# Altium schematic sheet Motors_DCVs.SchDoc
size C; SheetNumber: 3; SheetTotal: 4
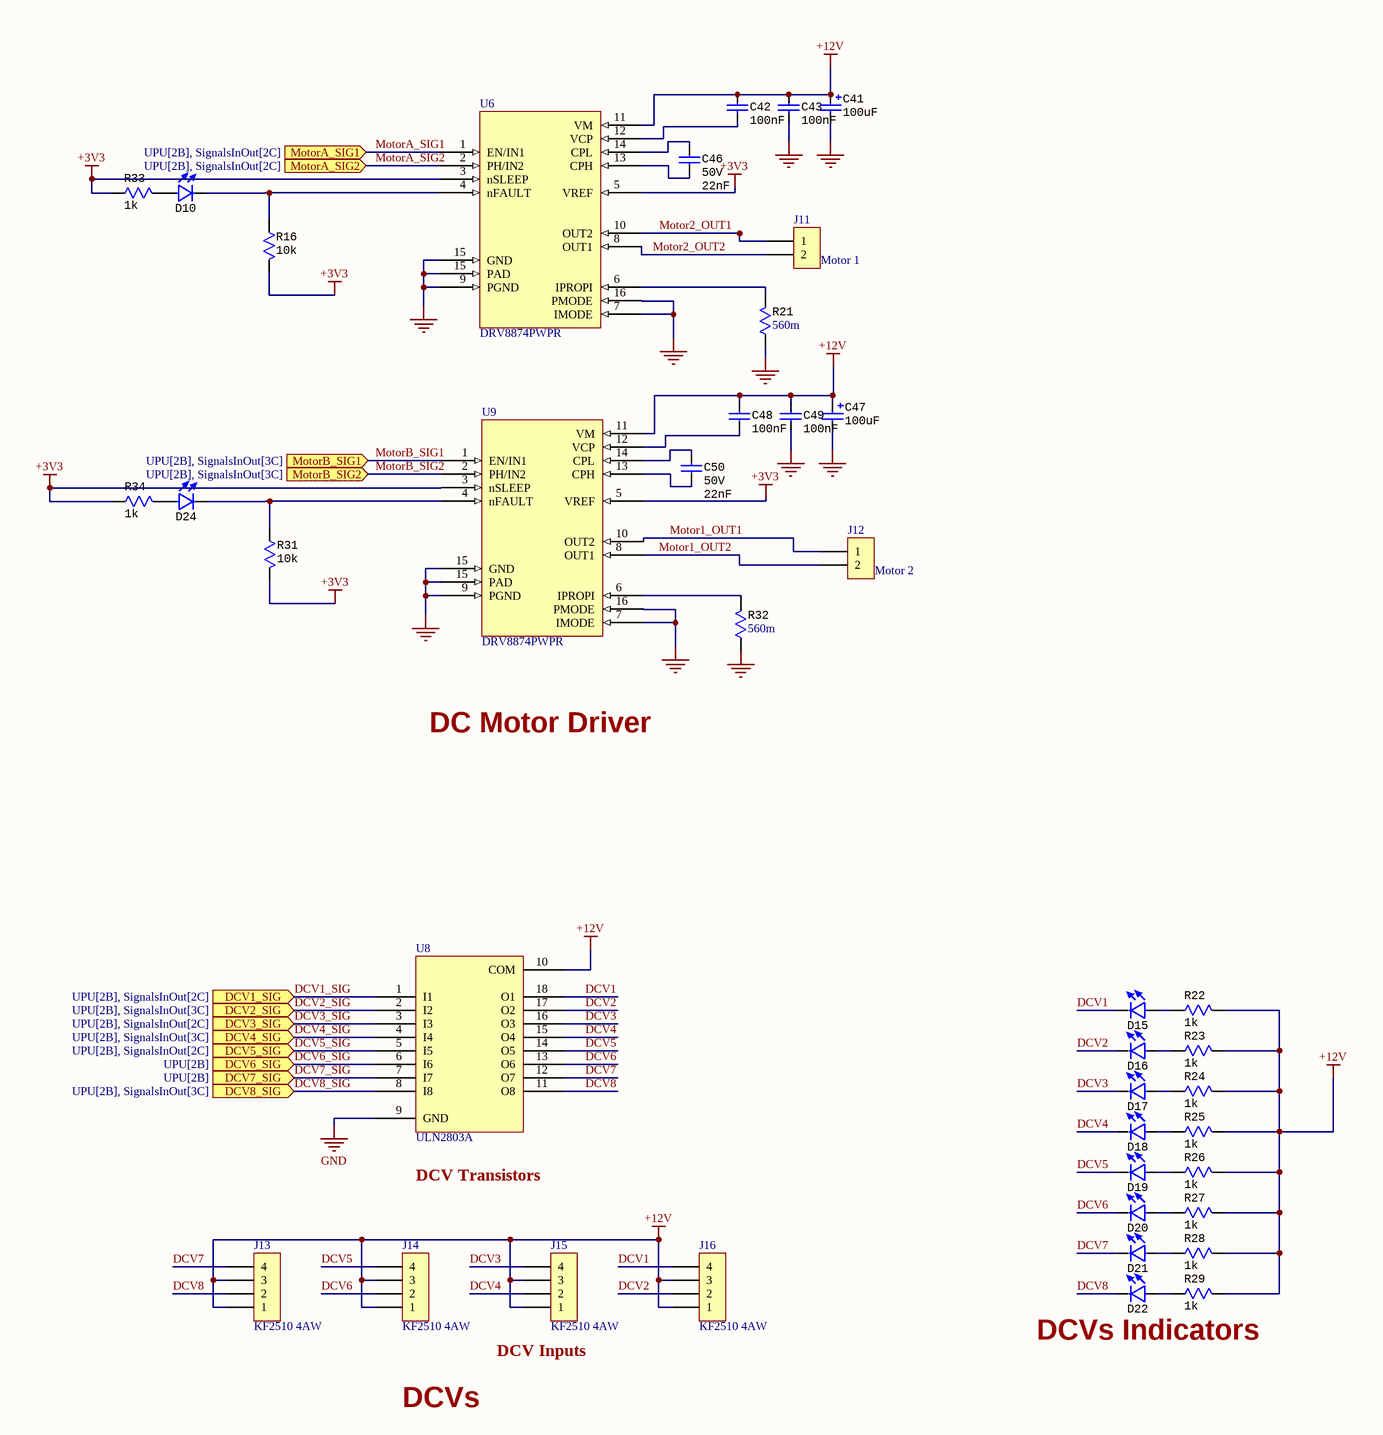
[diagram p0: Motors_DCVs.SchDoc]

## Parts
C41  100uF  [CAP Electrolytic SMD G_10X10.3X10.2(CPOL-EU153CLV-1010)]
C42  100nF  [CAP Ceramic SMD 0603]
C43  100nF  [CAP Ceramic SMD 0603]
C46  Voltage: 50V  [CAP Ceramic SMD 0603]  (hidden comment: 22nF)
C47  100uF  [CAP Electrolytic SMD G_10X10.3X10.2(CPOL-EU153CLV-1010)]
C48  100nF  [CAP Ceramic SMD 0603]
C49  100nF  [CAP Ceramic SMD 0603]
C50  Voltage: 50V  [CAP Ceramic SMD 0603]  (hidden comment: 22nF)
D10  (no value)  [LED SMD 0805R]
D15  (no value)  [LED SMD 0805G]
D16  (no value)  [LED SMD 0805G]
D17  (no value)  [LED SMD 0805G]
D18  (no value)  [LED SMD 0805G]
D19  (no value)  [LED SMD 0805G]
D20  (no value)  [LED SMD 0805G]
D21  (no value)  [LED SMD 0805G]
D22  (no value)  [LED SMD 0805G]
D24  (no value)  [LED SMD 0805R]
J11  Motor 1  [Connector MOLEX KK-254 KF2510-2AW 2 90deg]
J12  Motor 2  [Connector MOLEX KK-254 KF2510-2AW 2 90deg]
J13  KF2510 4AW  [Connector MOLEX KK-254 KF2510-4AW 4 90deg]
J14  KF2510 4AW  [Connector MOLEX KK-254 KF2510-4AW 4 90deg]
J15  KF2510 4AW  [Connector MOLEX KK-254 KF2510-4AW 4 90deg]
J16  KF2510 4AW  [Connector MOLEX KK-254 KF2510-4AW 4 90deg]
R16  value 10k  [RES SMD 0603]  (hidden comment: 10kR)
R21  560m  [RES SMD 0603]
R22  value 1k  [RES SMD 0603]  (hidden comment: 1kR)
R23  value 1k  [RES SMD 0603]  (hidden comment: 1kR)
R24  value 1k  [RES SMD 0603]  (hidden comment: 1kR)
R25  value 1k  [RES SMD 0603]  (hidden comment: 1kR)
R26  value 1k  [RES SMD 0603]  (hidden comment: 1kR)
R27  value 1k  [RES SMD 0603]  (hidden comment: 1kR)
R28  value 1k  [RES SMD 0603]  (hidden comment: 1kR)
R29  value 1k  [RES SMD 0603]  (hidden comment: 1kR)
R31  value 10k  [RES SMD 0603]  (hidden comment: 10kR)
R32  560m  [RES SMD 0603]
R33  value 1k  [RES SMD 0603]  (hidden comment: 1kR)
R34  value 1k  [RES SMD 0603]  (hidden comment: 1kR)
U6  DRV8874PWPR  [DRV8874PWPR]
U8  ULN2803A  [ULN2803A]
U9  DRV8874PWPR  [DRV8874PWPR]

## Ports
DCV1_SIG (in, see UPU[2B], SignalsInOut[2C]), DCV2_SIG (in, see UPU[2B], SignalsInOut[3C]), DCV3_SIG (in, see UPU[2B], SignalsInOut[2C]), DCV4_SIG (in, see UPU[2B], SignalsInOut[3C]), DCV5_SIG (in, see UPU[2B], SignalsInOut[2C]), DCV6_SIG (in, see UPU[2B]), DCV7_SIG (in, see UPU[2B]), DCV8_SIG (in, see UPU[2B], SignalsInOut[3C]), MotorA_SIG1 (in, see UPU[2B], SignalsInOut[2C]), MotorA_SIG2 (in, see UPU[2B], SignalsInOut[2C]), MotorB_SIG1 (in, see UPU[2B], SignalsInOut[3C]), MotorB_SIG2 (in, see UPU[2B], SignalsInOut[3C])

## Nets
+3V3: R16.2 R31.2 R33.1 R34.1 U6.3(nSLEEP) U6.5(VREF) U9.3(nSLEEP) U9.5(VREF)
+12V: C41.1 C42.1 C43.1 C47.1 C48.1 C49.1 J13.1 J13.3 J14.1 J14.3 J15.1 J15.3 J16.1 J16.3 R22.2 R23.2 R24.2 R25.2 R26.2 R27.2 R28.2 R29.2 U6.11(VM) U8.10(COM) U9.11(VM)
GND: C41.2 C43.2 C47.2 C49.2 R21.1 R32.1 U6.7(IMODE) U6.9(PGND) U6.15(GND) U6.16(PMODE) U8.9(GND) U9.7(IMODE) U9.9(PGND) U9.15(GND) U9.16(PMODE)
DCV1: D15.2 J16.4 U8.18(O1)
DCV1_SIG: U8.1(I1) ; port DCV1_SIG
DCV2: D16.2 J16.2 U8.17(O2)
DCV2_SIG: U8.2(I2) ; port DCV2_SIG
DCV3: D17.2 J15.4 U8.16(O3)
DCV3_SIG: U8.3(I3) ; port DCV3_SIG
DCV4: D18.2 J15.2 U8.15(O4)
DCV4_SIG: U8.4(I4) ; port DCV4_SIG
DCV5: D19.2 J14.4 U8.14(O5)
DCV5_SIG: U8.5(I5) ; port DCV5_SIG
DCV6: D20.2 J14.2 U8.13(O6)
DCV6_SIG: U8.6(I6) ; port DCV6_SIG
DCV7: D21.2 J13.4 U8.12(O7)
DCV7_SIG: U8.7(I7) ; port DCV7_SIG
DCV8: D22.2 J13.2 U8.11(O8)
DCV8_SIG: U8.8(I8) ; port DCV8_SIG
Motor1_OUT1: J12.1 U9.10(OUT2)
Motor1_OUT2: J12.2 U9.8(OUT1)
Motor2_OUT1: J11.1 U6.10(OUT2)
Motor2_OUT2: J11.2 U6.8(OUT1)
MotorA_SIG1: U6.1(EN/IN1) ; port MotorA_SIG1
MotorA_SIG2: U6.2(PH/IN2) ; port MotorA_SIG2
MotorB_SIG1: U9.1(EN/IN1) ; port MotorB_SIG1
MotorB_SIG2: U9.2(PH/IN2) ; port MotorB_SIG2
NetC42_2: C42.2 U6.12(VCP)
NetC46_1: C46.1 U6.14(CPL)
NetC46_2: C46.2 U6.13(CPH)
NetC48_2: C48.2 U9.12(VCP)
NetC50_1: C50.1 U9.14(CPL)
NetC50_2: C50.2 U9.13(CPH)
NetD10_1: D10.1 R33.2
NetD10_2: D10.2 R16.1 U6.4(nFAULT)
NetD15_1: D15.1 R22.1
NetD16_1: D16.1 R23.1
NetD17_1: D17.1 R24.1
NetD18_1: D18.1 R25.1
NetD19_1: D19.1 R26.1
NetD20_1: D20.1 R27.1
NetD21_1: D21.1 R28.1
NetD22_1: D22.1 R29.1
NetD24_1: D24.1 R34.2
NetD24_2: D24.2 R31.1 U9.4(nFAULT)
NetR21_2: R21.2 U6.6(IPROPI)
NetR32_2: R32.2 U9.6(IPROPI)

## Notes on the sheet
- DC Motor Driver
- (near U8) DCV Transistors
- (near J15) DCV Inputs
- DCVs Indicators
- DCVs

## Library data of the parts
C41 C47 = CAP ELEC 100uF 68V: -40℃~+105℃ 2000hrs@105℃ 100uF 10.2mm 63V 10mm ±20% SMD,D10xL10.2mm Aluminum Electrolytic Capacitors - SMD ROHS; Manufacturer: ROQANG; Manufacturer Part Number: RT1J101M1010; ComponentLink1Description: Datasheet; ComponentLink1URL: https://datasheet.lcsc.com/lcsc/1809061214_Nichicon-UWX1C101MCL1GB_C111600.pdf; Supplier: LCSC; Supplier Part Number: C280414; Capacitance: 100uF
C42 C43 C48 C49 = CAP 0603 100nF 100V: 0603 0.1 uF 100 V ±10% Tolerance X7R Multilayer Ceramic Capacitor; Manufacturer: Yageo; Manufacturer Part Number: AC0603KRX7R0BB104; Voltage Rating: 100V; Supplier: LCSC; Supplier Part Number: C408909; RoHS: Yes; Category: Ceramic Capacitors; Stock 1: 6927977; Pricing 1: 1=0.17000, 10=0.11900, 50=0.06760, 100=0.05590, 500=0.03922, 1000=0.03246 (USD); Mount: Surface Mount; Case/Package: 0603; Case Code (Metric): 1608; Case Code (Imperial): 0603; Weight: 7.1E-05oz; Min Operating Temperature: -55°C; Max Operating Temperature: 125°C; Package Quantity: 4000; Capacitance: 100nF; Tolerance: 10%; Packaging: Tape and Reel; Dielectric: X7R; Termination: SMD/SMT; Resistor Type: Ceramic; Voltage Rating (DC): 100V; Series: CC; Length: 0.063inch; Width: 0.031inch; Thickness: 0.035inch; Depth: 0.8mm; Lead Free: Lead Free; RoHS Compliant: Yes; ComponentLink1URL: https://datasheet.ciiva.com/6277/mlccorderingcode-6277082.pdf?src-supplier=Digi-Key; ComponentLink1Description: https://datasheet.ciiva.com/6277/mlccorderingcode-6277082.pdf?src-supplier=Digi-Key; ComponentLink2URL: https://datasheet.ciiva.com/6277/mlccorderingcode-6277081.pdf?src-supplier=Digi-Key; ComponentLink2Description: https://datasheet.ciiva.com/6277/mlccorderingcode-6277081.pdf?src-supplier=Digi-Key; ComponentLink3URL: https://datasheet.ciiva.com/6277/mlccorderingcode-6277030.pdf?src-supplier=Digi-Key; ComponentLink3Description: https://datasheet.ciiva.com/6277/mlccorderingcode-6277030.pdf?src-supplier=Digi-Key
C46 C50 = CAP 0603 22nF 50V: Ceramic capacitor SMD-0603 22nF /50V X7R# K +-10%, Samsung, RoHS; Manufacturer Part Number: CL10B223KB8NNNC; Tolerance: 10%; Dielectric: X7R; Supplier 1: LCSC; Supplier Part Number 1: C21122; Manufacturer: Samsung; RoHS: Yes; Category: Ceramic Capacitors; Stock 1: 380900; Pricing 1: 100=0.00480, 1000=0.00400, 4000=0.00360, 8000=0.00330, 48000=0.00310, 100000=0.00300 (USD); Mount: Surface Mount; Case/Package: 0603; Case Code (Metric): 1608; Case Code (Imperial): 0603; Contact Plating: Tin; Material: Ceramic; Min Operating Temperature: -55°C; Max Operating Temperature: 125°C; Voltage Rating (DC): 50V; Package Quantity: 1; Packaging: Tape and Reel; Voltage Rating: 50V; Series: CL; Construction: Flat; Length: 1.6mm; Width: 0.031inch; Height: 0.8mm; Thickness: 0.035inch; Depth: 0.8mm; Radiation Hardening: No; Lead Free: Lead Free; RoHS Compliant: Yes; ComponentLink1URL: https://datasheet.ciiva.com/25802/cl10b223kb8nnnc-25802289.pdf?src-supplier=Digi-Key; ComponentLink1Description: https://datasheet.ciiva.com/25802/cl10b223kb8nnnc-25802289.pdf?src-supplier=Digi-Key; ComponentLink2URL: https://datasheet.ciiva.com/26838/getdatasheetpartid-357419-26838449.pdf?src-supplier=Verical; ComponentLink2Description: https://datasheet.ciiva.com/26838/getdatasheetpartid-357419-26838449.pdf?src-supplier=Verical; ComponentLink3URL: https://datasheet.ciiva.com/29198/457190-da-01-en-vs-kondensator-0603-29198760.pdf?src-supplier=Conrad; ComponentLink3Description: https://datasheet.ciiva.com/29198/457190-da-01-en-vs-kondensator-0603-29198760.pdf?src-supplier=Conrad; ComponentLink4URL: https://datasheet.ciiva.com/26310/mlcc-catalogdownload2013-eng-26310316.pdf?src-supplier=Distrelec; ComponentLink4Description: https://datasheet.ciiva.com/26310/mlcc-catalogdownload2013-eng-26310316.pdf?src-supplier=Distrelec; ComponentLink5URL: https://datasheet.ciiva.com/16318/cl05b104kq5nnnc-16318246.pdf?src-supplier=Future+Electronics; ComponentLink5Description: https://datasheet.ciiva.com/16318/cl05b104kq5nnnc-16318246.pdf?src-supplier=Future+Electronics; Capacitance: 22nF
D10 D24 = LED 0805 Red: red 0805 Light Emitting Diodes (LED) ROHS; Manufacturer: FOSHAN Nationstar Optoelectronics; Manufacturer Part Number: NCD0805R1; Supplier: LCSC; Supplier Part Number: C84256; RoHS: No; Category: Uncategorized; Stock 1: 1189900; Pricing 1: 50=0.01160, 500=0.00900, 3000=0.00780, 6000=0.00700, 24000=0.00660, 51000=0.00640 (USD)
D15-D22 = LED 0805 Emerald: Manufacturer: FOSHAN Nationstar Optoelectronics; Manufacturer Part Number: NCD0805G1; Supplier 1: LCSC; Supplier Part Number 1: C84260; RoHS: No; Category: Uncategorized; Stock 1: 432460; Pricing 1: 20=0.01910, 200=0.01510, 600=0.01290, 3000=0.01160, 9000=0.01050, 21000=0.00990 (USD)
J11 J12 = KF2510 2AW: 1x2P 1 2.54mm Male pin 2 -25℃~+85℃ 3A Shrouded Push-Pull,P=2.54mm Wire To Board / Wire To Wire Connector ROHS; Manufacturer: CAX; ManufacturerPartNumber: 2510-2AW; Supplier: LCSC; SupplierPartNumber: C722717
J13-J16 = KF2510 4AW: 1x4P 1 2.54mm Male pin 4 -25℃~+85℃ 3A Shrouded Push-Pull,P=2.54mm Wire To Board / Wire To Wire Connector ROHS; Manufacturer: CAX; ManufacturerPartNumber: 2510-4AW; Supplier: LCSC; SupplierPartNumber: C722720
R16 R31 = RES 0603 10k 1%: Res Thick Film 0603 10K Ohm 1% 1/10W ±100ppm/°C Molded SMD Punched Carrier T/R; Manufacturer: Panasonic; Manufacturer Part Number: ERJ-3EKF1002V; Max Power Dissipation: 100mW; Voltage Rating: 75V; RoHS: Yes; Category: Chip SMD Resistors; Mount: Surface Mount; Case/Package: 0603; Number of Pins: 2; Case Code (Metric): 1608; Case Code (Imperial): 0603; Contact Plating: Tin; Size Code: 0603; Min Operating Temperature: -55°C; Max Operating Temperature: 155°C; Resistance: 10kR; Packaging: Tape and Reel; Resistor Type: Thick Film; Temperature Coefficient: 100ppm/°C; Tolerance: 1%; Number of Terminations: 2; Series: ERJ; Construction: Rectangular; Power Rating: 100mW; Features: Automotive AEC-Q200; Voltage Rating (DC): 75V; Package Quantity: 1; Resistance Tolerance: 1%; Termination: SMD/SMT; Technology: THICK FILM; Length: 1.6mm; Width: 0.031inch; Height: 0.45mm; Depth: 0.8mm; Radiation Hardening: No; RoHS Compliant: Yes; Military Standard: Not; Lead Free: Lead Free; REACH SVHC: No SVHC; ComponentLink1URL: https://datasheet.ciiva.com/7830/aoa0000ce2-7830729.pdf?src-supplier=Element14; ComponentLink1Description: https://datasheet.ciiva.com/7830/aoa0000ce2-7830729.pdf?src-supplier=Element14; ComponentLink2URL: https://datasheet.ciiva.com/46372/1678782-46372725.pdf?src-supplier=Element14; ComponentLink2Description: https://datasheet.ciiva.com/46372/1678782-46372725.pdf?src-supplier=Element14; ComponentLink3URL: https://datasheet.ciiva.com/28514/426256-28514198.pdf?src-supplier=Element14; ComponentLink3Description: https://datasheet.ciiva.com/28514/426256-28514198.pdf?src-supplier=Element14; ComponentLink4URL: https://datasheet.ciiva.com/24070/aoa0000ce2-24070318.pdf?src-supplier=Mouser; ComponentLink4Description: https://datasheet.ciiva.com/24070/aoa0000ce2-24070318.pdf?src-supplier=Mouser; ComponentLink5URL: https://datasheet.ciiva.com/16759/70260748-16759807.pdf?src-supplier=Allied+Electronics; ComponentLink5Description: https://datasheet.ciiva.com/16759/70260748-16759807.pdf?src-supplier=Allied+Electronics; ComponentLink6URL: https://datasheet.ciiva.com/9194/aoa0000ce2-9194199.pdf?src-supplier=Avnet; ComponentLink6Description: https://datasheet.ciiva.com/9194/aoa0000ce2-9194199.pdf?src-supplier=Avnet; ComponentLink7URL: https://datasheet.ciiva.com/48530/aoa0000ce2-48530988.pdf?src-supplier=Avnet; ComponentLink7Description: https://datasheet.ciiva.com/48530/aoa0000ce2-48530988.pdf?src-supplier=Avnet; ComponentLink8URL: https://datasheet.ciiva.com/30208/aoa0000ce2-30208985.pdf?src-supplier=Onlinecomponents.com; ComponentLink8Description: https://datasheet.ciiva.com/30208/aoa0000ce2-30208985.pdf?src-supplier=Onlinecomponents.com; Supplier 1: LCSC; Stock 1: 555600; Pricing 1: 50=0.010200, 500=0.008400, 1500=0.007300, 5000=0.006100, 25000=0.005500, 50000=0.005400 (AUD); Supplier Part Number 1: C191124
R21 R32 = RES 0603 560m 5%: 250mW Thick Film Resistors ±5% ±300ppm/℃ 560mΩ 0603 Chip Resistor - Surface Mount ROHS; Manufacturer: Panasonic; Manufacturer Part Number: ERJ-3BQJR56V; Tolerance: 5%; RoHS: Yes; Category: Chip SMD Resistors; Mount: Surface Mount; Case/Package: 0603; Resistance: 560m; Resistor Type: Thick Film; Number of Terminations: 2; Series: ERJ; Supplier: LCSC; Supplier Part Number: C2087100; Value: 560m
R22-R29 R33 R34 = RES 0603 1k 1%: Res Thick Film 0603 1K Ohm 1% 1/10W ±100ppm/°C Molded SMD Punched Carrier T/R; Manufacturer: Panasonic; Manufacturer Part Number: ERJ3EKF1001V; Power Rating: 100mW; Voltage Rating: 75V; Supplier 1: LCSC; RoHS: Yes; Category: Chip SMD Resistors; Stock 1: 79650; Pricing 1: 50=0.009600, 500=0.008100, 1500=0.007300, 5000=0.006800, 25000=0.006400, 50000=0.006200 (AUD); Mount: Surface Mount; Case/Package: 0603; Number of Pins: 2; Case Code (Metric): 1608; Case Code (Imperial): 0603; Contact Plating: Tin; Size Code: 0603; Min Operating Temperature: -55°C; Max Operating Temperature: 155°C; Packaging: Tape and Reel; Resistance: 1kR; Resistor Type: Thick Film; Temperature Coefficient: 100ppm/°C; Series: ERJ; Tolerance: 1%; Number of Terminations: 2; Max Power Dissipation: 100mW; Construction: Rectangular; Features: Automotive AEC-Q200; Package Quantity: 5000; Termination: SMD/SMT; Voltage Rating (DC): 75V; Resistance Tolerance: 1%; Technology: THICK FILM; Length: 1.6mm; Width: 0.8mm; Height: 0.45mm; Depth: 0.8mm; Radiation Hardening: No; RoHS Compliant: Yes; Lead Free: Lead Free; Military Standard: Not; REACH SVHC: No SVHC; ComponentLink1URL: https://datasheet.ciiva.com/7942/aoa0000ce2-7942427.pdf?src-supplier=Element14; ComponentLink1Description: https://datasheet.ciiva.com/7942/aoa0000ce2-7942427.pdf?src-supplier=Element14; ComponentLink2URL: https://datasheet.ciiva.com/46373/1678782-46373340.pdf?src-supplier=Element14; ComponentLink2Description: https://datasheet.ciiva.com/46373/1678782-46373340.pdf?src-supplier=Element14; ComponentLink3URL: https://datasheet.ciiva.com/22673/1678782-22673918.pdf?src-supplier=Element14; ComponentLink3Description: https://datasheet.ciiva.com/22673/1678782-22673918.pdf?src-supplier=Element14; ComponentLink4URL: https://datasheet.ciiva.com/46373/1678782-46373339.pdf?src-supplier=Element14; ComponentLink4Description: https://datasheet.ciiva.com/46373/1678782-46373339.pdf?src-supplier=Element14; ComponentLink5URL: https://datasheet.ciiva.com/24070/aoa0000ce2-24070269.pdf?src-supplier=Mouser; ComponentLink5Description: https://datasheet.ciiva.com/24070/aoa0000ce2-24070269.pdf?src-supplier=Mouser; ComponentLink6URL: https://datasheet.ciiva.com/16768/70260748-16768437.pdf?src-supplier=Allied+Electronics; ComponentLink6Description: https://datasheet.ciiva.com/16768/70260748-16768437.pdf?src-supplier=Allied+Electronics; ComponentLink7URL: https://datasheet.ciiva.com/16774/70260748-16774550.pdf?src-supplier=Allied+Electronics; ComponentLink7Description: https://datasheet.ciiva.com/16774/70260748-16774550.pdf?src-supplier=Allied+Electronics; ComponentLink8URL: https://datasheet.ciiva.com/9198/aoa0000ce2-9198923.pdf?src-supplier=Avnet; ComponentLink8Description: https://datasheet.ciiva.com/9198/aoa0000ce2-9198923.pdf?src-supplier=Avnet; ComponentLink9URL: https://datasheet.ciiva.com/16449/aoa0000ce2-16449065.pdf?src-supplier=Future+Electronics; ComponentLink9Description: https://datasheet.ciiva.com/16449/aoa0000ce2-16449065.pdf?src-supplier=Future+Electronics; ComponentLink10URL: https://datasheet.ciiva.com/48530/aoa0000ce2-48530987.pdf?src-supplier=Avnet; ComponentLink10Description: https://datasheet.ciiva.com/48530/aoa0000ce2-48530987.pdf?src-supplier=Avnet; ComponentLink11URL: https://datasheet.ciiva.com/30063/aoa0000ce2-30063390.pdf?src-supplier=Onlinecomponents.com; ComponentLink11Description: https://datasheet.ciiva.com/30063/aoa0000ce2-30063390.pdf?src-supplier=Onlinecomponents.com; Supplier Part Number 1: C118155
U6 U9 = DRV8874PWPR: 40-V, 6-A H-bridge motor driver with integrated current sensing feedback 16-HTSSOP -40 to 125; Manufacturer: Texas Instruments; Supplier: LCSC; Supplier Part Number: C1855818; Manufacturer Part Number: DRV8874PWPR; RoHS: Yes; Category: Integrated Circuits (ICs); Stock: 4498; Pricing: 1=3.39, 10=3.043, 25=2.8768, 100=2.4934, 250=2.36552, 500=2.12258, 1000=1.79012 (USD); ComponentLink1URL: http://www.ti.com/general/docs/suppproductinfo.tsp?distId=10&amp;gotoUrl=http%3A%2F%2Fwww.ti.com%2Flit%2Fgpn%2Fdrv8874&src-supplier=Digi-Key; ComponentLink1Description: http://www.ti.com/general/docs/suppproductinfo.tsp?distId=10&amp;gotoUrl=http%3A%2F%2Fwww.ti.com%2Flit%2Fgpn%2Fdrv8874&src-supplier=Digi-Key
U8 = ULN2803A: SOP-18-300mil Darlington Transistor Arrays ROHS; Manufacturer: UMW; Manufacturer Part Number: ULN2803A; Supplier Part Number: C845537; Supplier: LCSC